# Altium schematic sheet mcu.SchDoc
size A3; SheetNumber: 2; SheetTotal: 10
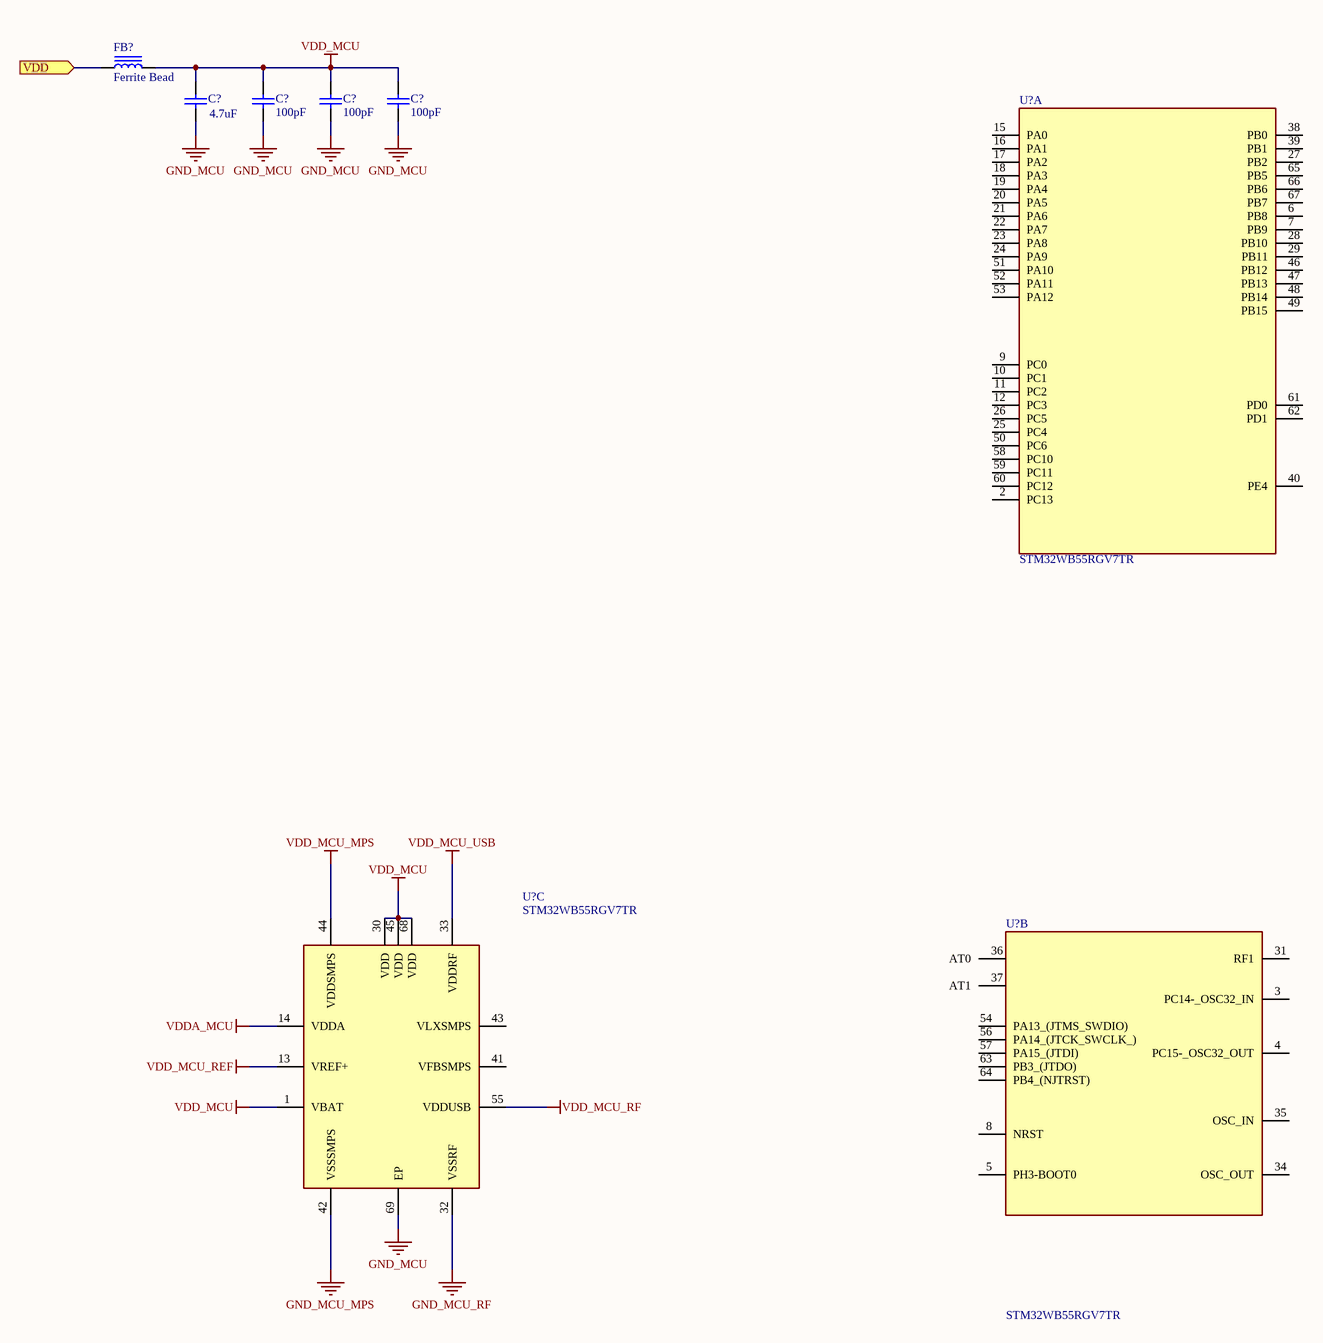
[diagram p0: mcu.SchDoc]

## Parts
(Parts that share a designator on the sheet are numbered #1, #2 ... from top to bottom, then left to right.)
C?#1  value 4.7uF  [RAD-0.3]  (hidden comment: Cap)
C?#2  value 100pF  [RAD-0.3]  (hidden comment: Cap)
C?#3  value 100pF  [RAD-0.3]  (hidden comment: Cap)
C?#4  value 100pF  [RAD-0.3]  (hidden comment: Cap)
FB?  Ferrite Bead
U?#1  STM32WB55RGV7TR  [ST-VFQFPN68-800X800X100]  (part A of 3)
U?#2  STM32WB55RGV7TR  [ST-VFQFPN68-800X800X100]  (part C of 3)
U?#3  STM32WB55RGV7TR  [ST-VFQFPN68-800X800X100]  (part B of 3)

## Ports
VDD (in)

## Nets
GND_MCU: C?#1.1 C?#2.1 C?#3.1 C?#4.1 U?#2.69(EP)
GND_MCU_MPS: U?#2.42(VSSSMPS)
GND_MCU_RF: U?#2.32(VSSRF)
VDD_MCU: C?#1.2 C?#2.2 C?#3.2 C?#4.2 FB?.2 U?#2.1(VBAT) U?#2.30(VDD) U?#2.45(VDD) U?#2.68(VDD)
VDD_MCU_MPS: U?#2.44(VDDSMPS)
VDD_MCU_REF: U?#2.13(VREF+)
VDD_MCU_RF: U?#2.55(VDDUSB)
VDD_MCU_USB: U?#2.33(VDDRF)
VDDA_MCU: U?#2.14(VDDA)
VDD: FB?.1 ; port VDD

Not connected (* = marked no-connect by the designer): U?#1 2(PC13) 6(PB8) 7(PB9) 9(PC0) 10(PC1) 11(PC2) 12(PC3) 15(PA0) 16(PA1) 17(PA2) 18(PA3) 19(PA4) 20(PA5) 21(PA6) 22(PA7) 23(PA8) 24(PA9) 25(PC4) 26(PC5) 27(PB2) 28(PB10) 29(PB11) 38(PB0) 39(PB1) 40(PE4) 46(PB12) 47(PB13) 48(PB14) 49(PB15) 50(PC6) 51(PA10) 52(PA11) 53(PA12) 58(PC10) 59(PC11) 60(PC12) 61(PD0) 62(PD1) 65(PB5) 66(PB6) 67(PB7); U?#2 41(VFBSMPS) 43(VLXSMPS); U?#3 3(PC14-_OSC32_IN) 4(PC15-_OSC32_OUT) 5(PH3-BOOT0) 8(NRST) 31(RF1) 34(OSC_OUT) 35(OSC_IN) 36(AT0) 37(AT1) 54(PA13_(JTMS_SWDIO)) 56(PA14_(JTCK_SWCLK_)) 57(PA15_(JTDI)) 63(PB3_(JTDO)) 64(PB4_(NJTRST))

## Library data of the parts
C?#1-C?#4 = Cap: Capacitor; Published: 8-Jun-2000; LatestRevisionDate: 17-Jul-2002; LatestRevisionNote: Re-released for DXP Platform.; PackageReference: RAD-0.3; Publisher: Altium Limited; PackageDescription: Radial Cap, Thru-Hole; 2 Leads; 0.3 in Pin Spacing
U?#1-U?#3 = STM32WB55RGV7TR: RF System on a Chip - SoC; Manufacturer_Name: STMicroelectronics; Geometry.Height: 1mm; Description 1: RISC Microcontroller, 32-Bit, FLASH, CORTEX-M4 CPU, 64MHz, CMOS; Category 1: Microcontrollers; Interface: I2C,SPI,USB,UART,USART; Frequency: 2.48GHz; Data Rate: 2Mbps; Sensitivity: -100dBm; Memory Size: 256KB; Current - Receiving: 7.9mA; Current - Transmitting: 12.7mA; Number of GPIO: 49; Core Architecture: 6081CoreArchitecture; Density: 1MB; Max Supply Voltage: 3.6V; Min Supply Voltage: 1.71V; Nominal Supply Current: 40nA; Number of A/D Converters: 1NUMBER; Number of Channels: 19NUMBER; Number of I2C Channels: 2NUMBER; Number of I/Os: 49NUMBER; Mouser Part Number: 511-STM32WB55RGV7TR; Mouser Price/Stock: https://www.mouser.co.uk/ProductDetail/STMicroelectronics/STM32WB55RGV7TR?qs=vLWxofP3U2xKfjHbys%252Bhaw%3D%3D; Manufacturer_Part_Number: STM32WB55RGV7TR; Datasheet Link: https://www.st.com/resource/en/datasheet/stm32wb55cc.pdf; Supplier 1: Digikey; Supplier Part Number 1: 497-STM32WB55RGV7TRCT-ND; Manufacturer 1: STMicroelectronics; Manufacturer Part Number 1: STM32WB55RGV7TR; RoHS 1: Yes; Stock 1: 7460; Pricing 1: 1=8.82, 10=7.965, 25=7.5948, 100=6.5945, 250=6.29812, 500=5.74242, 1000=5.00145 (USD); Mount: Surface Mount; Min Operating Temperature: -40°C; Max Operating Temperature: 105°C; Series: -; Number of SPI Channels: 2NUMBER; Number of Timers/Counters: 1NUMBER; Number of UART Channels: 1NUMBER; RAM Size: 256KB; RoHS Compliant: Yes; Supplier 2: Digikey; Supplier Part Number 2: 497-STM32WB55RGV7TRDKR-ND; Manufacturer 2: STMicroelectronics; Manufacturer Part Number 2: STM32WB55RGV7TR; RoHS 2: Yes; Description 2: RISC Microcontroller, 32-Bit, FLASH, CORTEX-M4 CPU, 64MHz, CMOS; Category 2: Microcontrollers; Stock 2: 7460; Pricing 2: 1=8.82, 10=7.965, 25=7.5948, 100=6.5945, 250=6.29812, 500=5.74242, 1000=5.00145 (USD); Supplier 3: Digikey; Supplier Part Number 3: 497-STM32WB55RGV7TR-ND; Manufacturer 3: STMicroelectronics; Manufacturer Part Number 3: STM32WB55RGV7TR; RoHS 3: Yes; Description 3: RISC Microcontroller, 32-Bit, FLASH, CORTEX-M4 CPU, 64MHz, CMOS; Category 3: Microcontrollers; Stock 3: 5000; Pricing 3: 2500=4.58512 (USD)